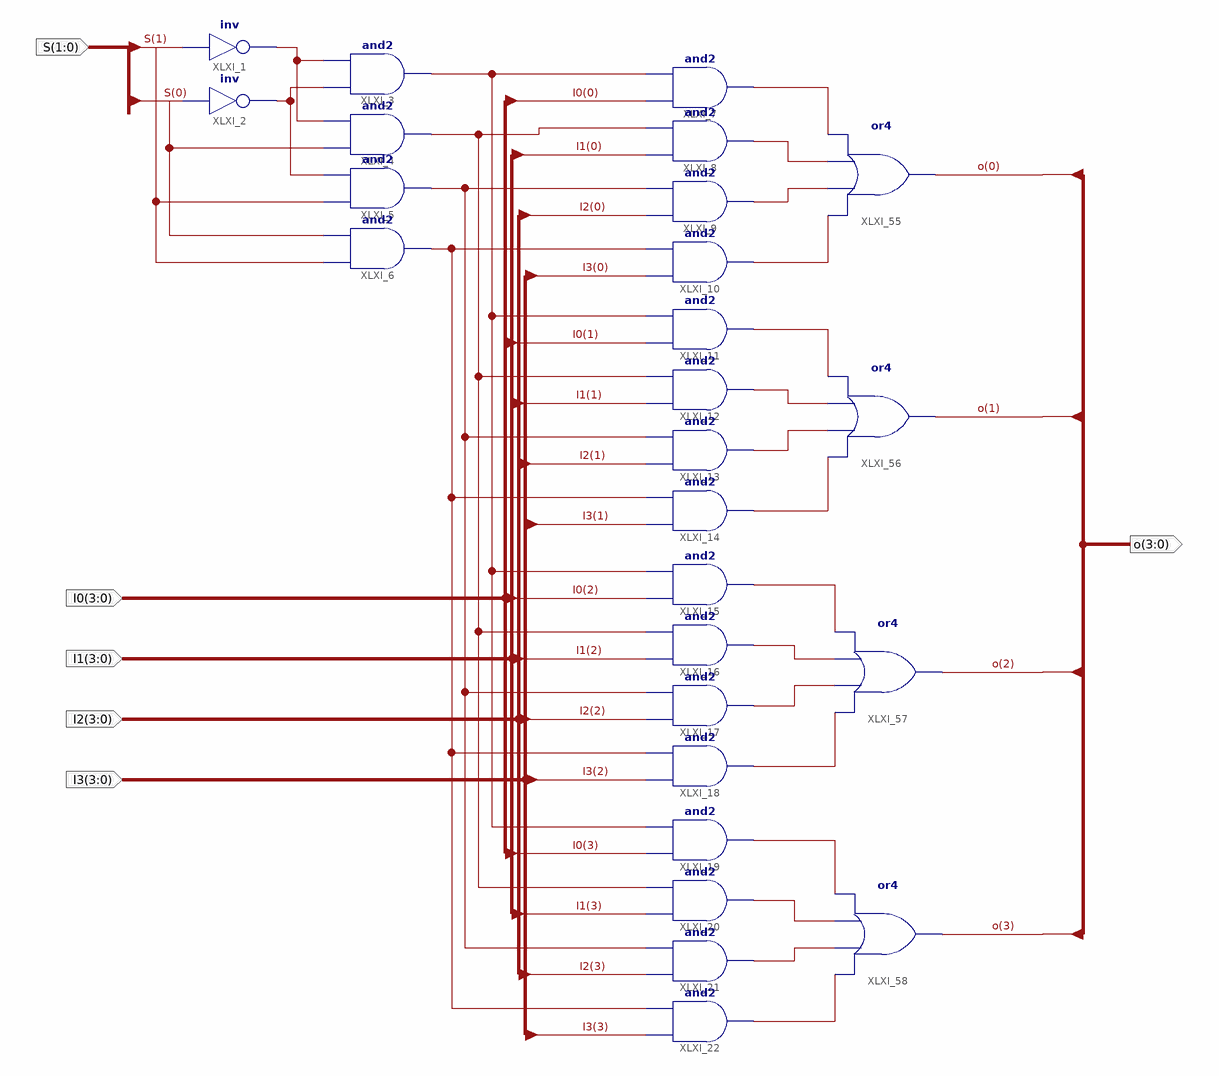
[diagram p0: schematic sheet 1]
// Xilinx ISE schematic Mux4to1b4.sch (kintex7) as structural Verilog: 26 symbols, 6 ports
module Mux4to1b4 (
  input  [1:0] S,
  input  [3:0] I0,
  input  [3:0] I1,
  input  [3:0] I2,
  input  [3:0] I3,
  output [3:0] o
);

  wire XLXN_4, XLXN_6, XLXN_22, XLXN_23, XLXN_26, XLXN_28, XLXN_61, XLXN_62, XLXN_63, XLXN_64, XLXN_65,
       XLXN_66, XLXN_67, XLXN_68, XLXN_69, XLXN_70, XLXN_71, XLXN_72, XLXN_73, XLXN_74, XLXN_75, XLXN_76;

  not XLXI_1 (XLXN_4, S[1]);
  not XLXI_2 (XLXN_6, S[0]);
  and XLXI_3 (XLXN_22, XLXN_6, XLXN_4);
  and XLXI_4 (XLXN_23, S[0], XLXN_4);
  and XLXI_5 (XLXN_26, S[1], XLXN_6);
  and XLXI_6 (XLXN_28, S[1], S[0]);
  and XLXI_7 (XLXN_61, I0[0], XLXN_22);
  and XLXI_8 (XLXN_62, I1[0], XLXN_23);
  and XLXI_9 (XLXN_63, I2[0], XLXN_26);
  and XLXI_10 (XLXN_64, I3[0], XLXN_28);
  and XLXI_11 (XLXN_65, I0[1], XLXN_22);
  and XLXI_12 (XLXN_66, I1[1], XLXN_23);
  and XLXI_13 (XLXN_67, I2[1], XLXN_26);
  and XLXI_14 (XLXN_68, I3[1], XLXN_28);
  and XLXI_15 (XLXN_69, I0[2], XLXN_22);
  and XLXI_16 (XLXN_70, I1[2], XLXN_23);
  and XLXI_17 (XLXN_71, I2[2], XLXN_26);
  and XLXI_18 (XLXN_72, I3[2], XLXN_28);
  and XLXI_19 (XLXN_73, I0[3], XLXN_22);
  and XLXI_20 (XLXN_74, I1[3], XLXN_23);
  and XLXI_21 (XLXN_75, I2[3], XLXN_26);
  and XLXI_22 (XLXN_76, I3[3], XLXN_28);
  or XLXI_55 (o[0], XLXN_64, XLXN_63, XLXN_62, XLXN_61);
  or XLXI_56 (o[1], XLXN_68, XLXN_67, XLXN_66, XLXN_65);
  or XLXI_57 (o[2], XLXN_72, XLXN_71, XLXN_70, XLXN_69);
  or XLXI_58 (o[3], XLXN_76, XLXN_75, XLXN_74, XLXN_73);
endmodule
